# Altium project USB_Project.PrjPcb
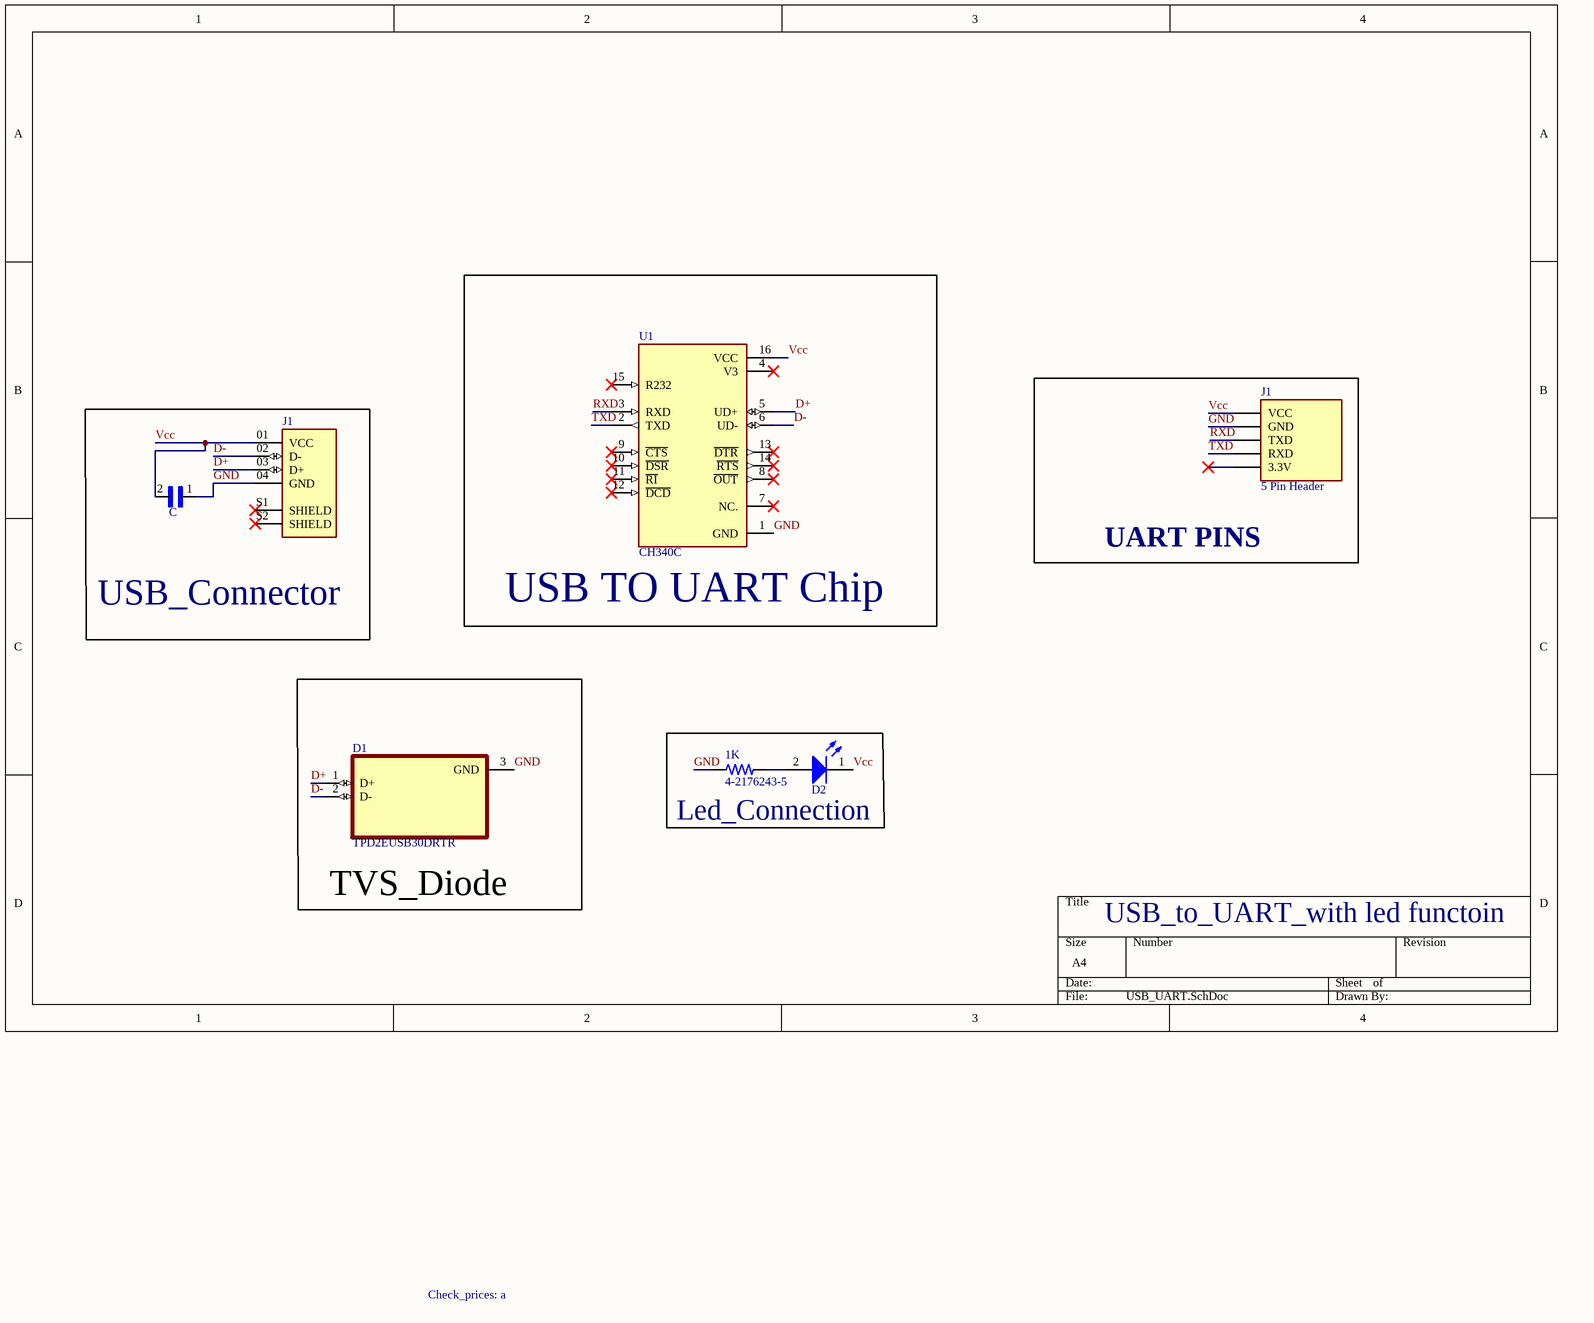
[diagram p0: USB_UART.SchDoc]
1 sheet, 7 parts. Net scope: global (net labels, ports and power ports of the same name join across sheets).
Board file: USB_UART.PcbDoc

## Sheet USB_UART.SchDoc
size A4; SheetNumber: 1; SheetTotal: 1; SPICEModelCacheXVZGTXEP: <root> / <DocumentId>XVZGTXEP</DocumentId> / <CacheFrame Number="0"> / <Model Name="3mm_151033bs03000" Kind="CKT"> / <Text>************************************************** / * Manufacturer:           Wurth Elektronik / * Kinds:                  THT Mono-color Round Waterclear / * Matchcode:              WL-TMRW / * Library Type:           LTspice / * Version:                rev22a / * Created/modified by:    Ella / * Date and Time:          2022-02-23 / * Team:                   eiSos EDA Service / * Contact:                libraries@we-online.com / ************************************************** / * Copyright(C) 2022 WÃ¼rth Elektronik eiSos GmbH &amp; Co. KG / * All Rights Reserved. / ************************************************** / * Disclaimer: While WÃ¼rth Elektronik eiSos has made every reasonable effort to ensure the accuracy / * of the simulation models provided, WÃ¼rth Elektronik eiSos does not guarantee the exemption of error on / * the simulation models, nor does WÃ¼rth Elektronik eiSos guarantee that the simulation model is current. / * WÃ¼rth Elektronik eiSos reserves the right to make any adjustments at any time without notice. / * WÃ¼rth Elektronik eiSos expressly disclaims all implied warranties regarding this simulation model. / ************************************************** / .subckt 3mm_151033BS03000  1  2 / D1 1 2 TMRW / .MODEL TMRW D / + IS=273.29E-18 / + N=2.9601 / + RS=1.0279 / + IKF=191.62E-6 / + CJO=1.0000E-12 / + M=.3333 / + VJ=.75 / + BV=5 / + IBV=50.00E-6 / + TT=5.0000E-9 / .ends</Text> / </Model> / </CacheFrame> / </root>

### Parts
(Parts that share a designator on the sheet are numbered #1, #2 ... from top to bottom, then left to right.)
1K  4-2176243-5  [RESC1608X50N]
C  GRM188R71C104KA01D  [CAPC1608X90N]  (value not drawn)
D1  TPD2EUSB30DRTR  Check_prices: a  [SOTFL35P100X50-3N]
D2  Blue, 2.8V, 30°  [WL-TMRW_D3.9H10.5]  (value not drawn)
J1#1  5 Pin Header  [SAMTEC_TSW-105-06-L-S]
J1#2  USB-AM-S-X-X-TH  [SAMTEC_USB-AM-S-X-X-TH]  (value not drawn)
U1  CH340C  [SOIC127P600X180-16N]

### Blocks framed on the sheet
USB TO UART Chip: U1
USB_Connector: C J1#2
UART PINS: J1#1
Led_Connection: 1K D2

### Nets
D+: D1.1(D+) J1#2.03(D+) U1.5(UD+)
D-: D1.2(D-) J1#2.02(D-) U1.6(UD-)
GND: 1K.1 C.1 D1.3(GND) J1#1.02(GND) J1#2.04(GND) U1.1(GND)
RXD: J1#1.03(TXD) U1.3(RXD)
TXD: J1#1.04(RXD) U1.2(TXD)
Vcc: C.2 D2.1(K) J1#1.01(VCC) J1#2.01(VCC) U1.16(VCC)
Net1K_2: 1K.2 D2.2(A)

Not connected (* = marked no-connect by the designer): J1#1 05(3.3V)*; J1#2 S1(SHIELD)* S2(SHIELD)*; U1 4(V3)* 7(NC.)* 8(~{OUT})* 9(~{CTS})* 10(~{DSR})* 11(~{RI})* 12(~{DCD})* 13(~{DTR})* 14(~{RTS})* 15(R232)*

### Notes on the sheet
- TVS_Diode
- USB_to_UART_with led functoin

### Library data of the parts
1K = 4-2176243-5: CRGS0603J4K7 - Each; Package: None; Price: None; Value: *; MP: 4-2176243-5; Availability: Unavailable
C = GRM188R71C104KA01D: SMD Capacitor X7R_EIA_ with Capacitance: 0.10uF Tol. 10%. Rated Voltage: 16Vdc; MF: Murata; SnapEDA_Link: https://www.snapeda.com/parts/GRM188R71C104KA01D/Murata%20Electronics%20North%20America/view-part/12287/?ref=snap; Price: None; MP: GRM188R71C104KA01D; Value: *; Availability: Unavailable; Package: 1608 Murata
D1 = TPD2EUSB30DRTR: MF: Texas Instruments; Package: SOT-9X3-3 Texas Instruments; Purchase-URL: https://pricing.snapeda.com/search/part/TPD2EUSB30DRTR/?ref=eda; Value: *; MP: TPD2EUSB30DRTR; Availability: Warning; SnapEDA_Link: https://www.snapeda.com/parts/TPD2EUSB30DRTR/Texas%20Instruments/view-part/189118/?ref=snap; Price: None
D2 = 151033BS03000: WL-TMRW Mono-color Round Waterclear, THT, D3.9 x H10.5mm, Blue, 2.8V, 30°; Manufacturer: Wurth Elektronik; Chip Technology: InGaN; Dominant Wavelength: 470nm; Luminous Intensity: 3800mcd; Peak Wavelength: 465nm; Manufacturer Part Number: 151033BS03000; Category: Signal LEDs; Match Code: WL-TMRW; ComponentLink1Description: Website Link; ComponentLink1URL: https://www.we-online.com/redexpert/article/151033BS03000?ad; ComponentLink2Description: Datasheet Link; ComponentLink2URL: https://www.we-online.com/redexpert/spec/151033BS03000?ad; Mount: Through Hole; Operating Temperature Max: 85°C; Operating Temperature Min: -40°C; Packaging: Bulk; Height: 10.5mm; Diameter: 3.9mm; Emitting Color: Blue; Forward Voltage: 2.8V; Viewing Angle: 30°
J1#1 = TSW-105-06-L-S: Package: None; Price: None; Value: *; MP: TSW-105-06-L-S; Availability: Unavailable
J1#2 = USB-AM-S-X-X-TH: USB Connectors USB 2.0 Interface, Type A; MF: Samtec; MP: USB-AM-S-S-W-TH; Value: *; SnapEDA_Link: https://www.snapeda.com/parts/USB-AM-S-S-W-TH/Samtec/view-part/?ref=snap; Purchase-URL: https://pricing.snapeda.com/search/part/USB-AM-S-S-W-TH/?ref=eda; Availability: In Stock; Price: None; Package: None; Check_prices: https://www.snapeda.com/parts/USB-AM-S-S-W-TH/Samtec/view-part/?ref=eda
U1 = CH340C: USB to serial chip CH340; MF: WCH; Price: None; Availability: Not in stock; MP: CH340C; Package: None; SnapEDA_Link: https://www.snapeda.com/parts/CH340C/WCH/view-part/?ref=snap; Check_prices: https://www.snapeda.com/parts/CH340C/WCH/view-part/?ref=eda; Value: *